# Altium schematic sheet Line  Reader FINAL.SchDoc
size A
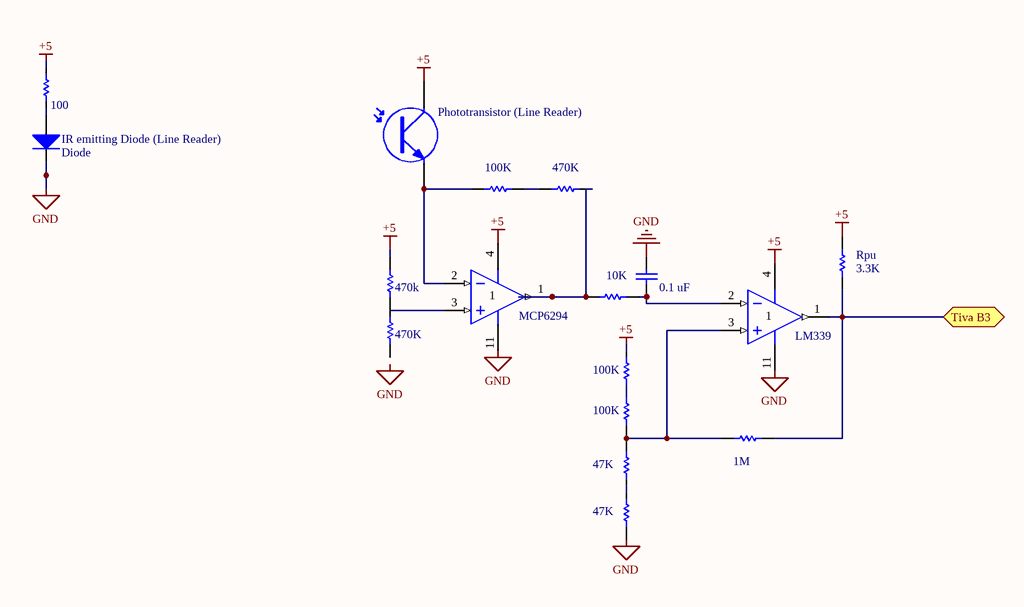
[diagram p0: Line  Reader FINAL.SchDoc]

## Parts
(Parts that share a designator on the sheet are numbered #1, #2 ... from top to bottom, then left to right.)
C?  value 0.1 uF  [RAD-0.3]  (hidden comment: Cap)
IR_emitting_Diode_(Line_Reader)  Diode  [DSO-C2/X3.3]
OpAmp1  MCP6294  [DIP-14]  (part A of 4)
OpAmp?  LM339  [DIP-14]  (part A of 4)
Phototransistor_(Line_Reader)  LTR 3208  [SFM-T2(3)/X1.6V]  (value not drawn)
R1  100  [AXIAL-0.3]
R4  100K  [AXIAL-0.3]
R?#1  value 470K  [AXIAL-0.3]  (hidden comment: Res1)
R?#2  470k  [AXIAL-0.3]
R?#3  value 10K  [AXIAL-0.3]  (hidden comment: Res1)
R?#4  470K  [AXIAL-0.3]
R?#5  100K  [AXIAL-0.3]
R?#6  value 100K  [AXIAL-0.3]  (hidden comment: Res1)
R?#7  1M  [AXIAL-0.3]
R?#8  47K  [AXIAL-0.3]
R?#9  value 47K  [AXIAL-0.3]  (hidden comment: Res1)
Rpu  3.3K  [AXIAL-0.3]

## Ports
Tiva B3

## Nets
+5: OpAmp1.4(V+) OpAmp?.4(V+) Phototransistor_(Line_Reader).1(C) R1.2 R?#2.1 R?#5.2 Rpu.2
GND: C?.1 IR_emitting_Diode_(Line_Reader).2(K) OpAmp1.11(GND) OpAmp?.11(GND) R?#9.1
Tiva B3: OpAmp?.1(OUT) R?#7.1 Rpu.1 ; port Tiva B3
NetC?_2: C?.2 OpAmp?.2(IN-) R?#3.2
NetIR_emitting_Diode_(Line_Reader)_1: IR_emitting_Diode_(Line_Reader).1(A) R1.1
NetOpAmp1_1: OpAmp1.1(OUT) R?#1.2 R?#3.1
NetOpAmp1_2: OpAmp1.2(IN-) Phototransistor_(Line_Reader).3(E) R4.1
NetOpAmp1_3: OpAmp1.3(IN+) R?#2.2
NetOpAmp?_3: OpAmp?.3(IN+) R?#6.1 R?#7.2 R?#8.2
NetR4_2: R4.2 R?#1.1
NetR?#5_1: R?#5.1 R?#6.2
NetR?#8_1: R?#8.1 R?#9.2

Not connected (* = marked no-connect by the designer): R?#4 1 2

## Notes on the sheet
- Labels drawn without touching a wire or pin: GND

## Library data of the parts
C? = Cap: Capacitor; Manufacturer: Generic Components; Class: Passive; Published: 08/06/2000; Publisher: Altium Hobart Technology Centre; SubClass: Capacitor
IR_emitting_Diode_(Line_Reader) = Diode: Default Diode; Manufacturer: Generic Components; Class: Discrete; SubClass: Diode - Switching; Published: 08/06/2000; Publisher: Altium Hobart Technology Centre
OpAmp1 OpAmp? = LM324AJ: Low-Power Quad Operational Amplifier; Manufacturer: National Semiconductor; Published: 15/04/2002; Publisher: Altium Hobart Technology Centre; Class: Amplifier; SubClass: Operational Amplifier
Phototransistor_(Line_Reader) = Photo NPN: NPN Phototransistor; Manufacturer: Generic Components; Class: Optoelectronic; Published: 1999; Name: LTR 3208
R1 R4 R?#1-R?#9 Rpu = Res1: Resistor; Manufacturer: Generic Components; Class: Passive; Published: 08/06/2000; Publisher: Altium Hobart Technology Centre; SubClass: Resistor
  R1: Value: 100
  R4 R?#5: Value: 100K
  R?#2: Value: 470k
  R?#4: Value: 470K
  R?#7: Value: 1M
  R?#8: Value: 47K
  Rpu: Value: 3.3K